# Altium schematic sheet Master.SchDoc: QUTMS Shutdown Board V2.1 - Master Bottom
size A3; DocumentNumber: 1; Revision: 4; SheetNumber: 1; SheetTotal: 7
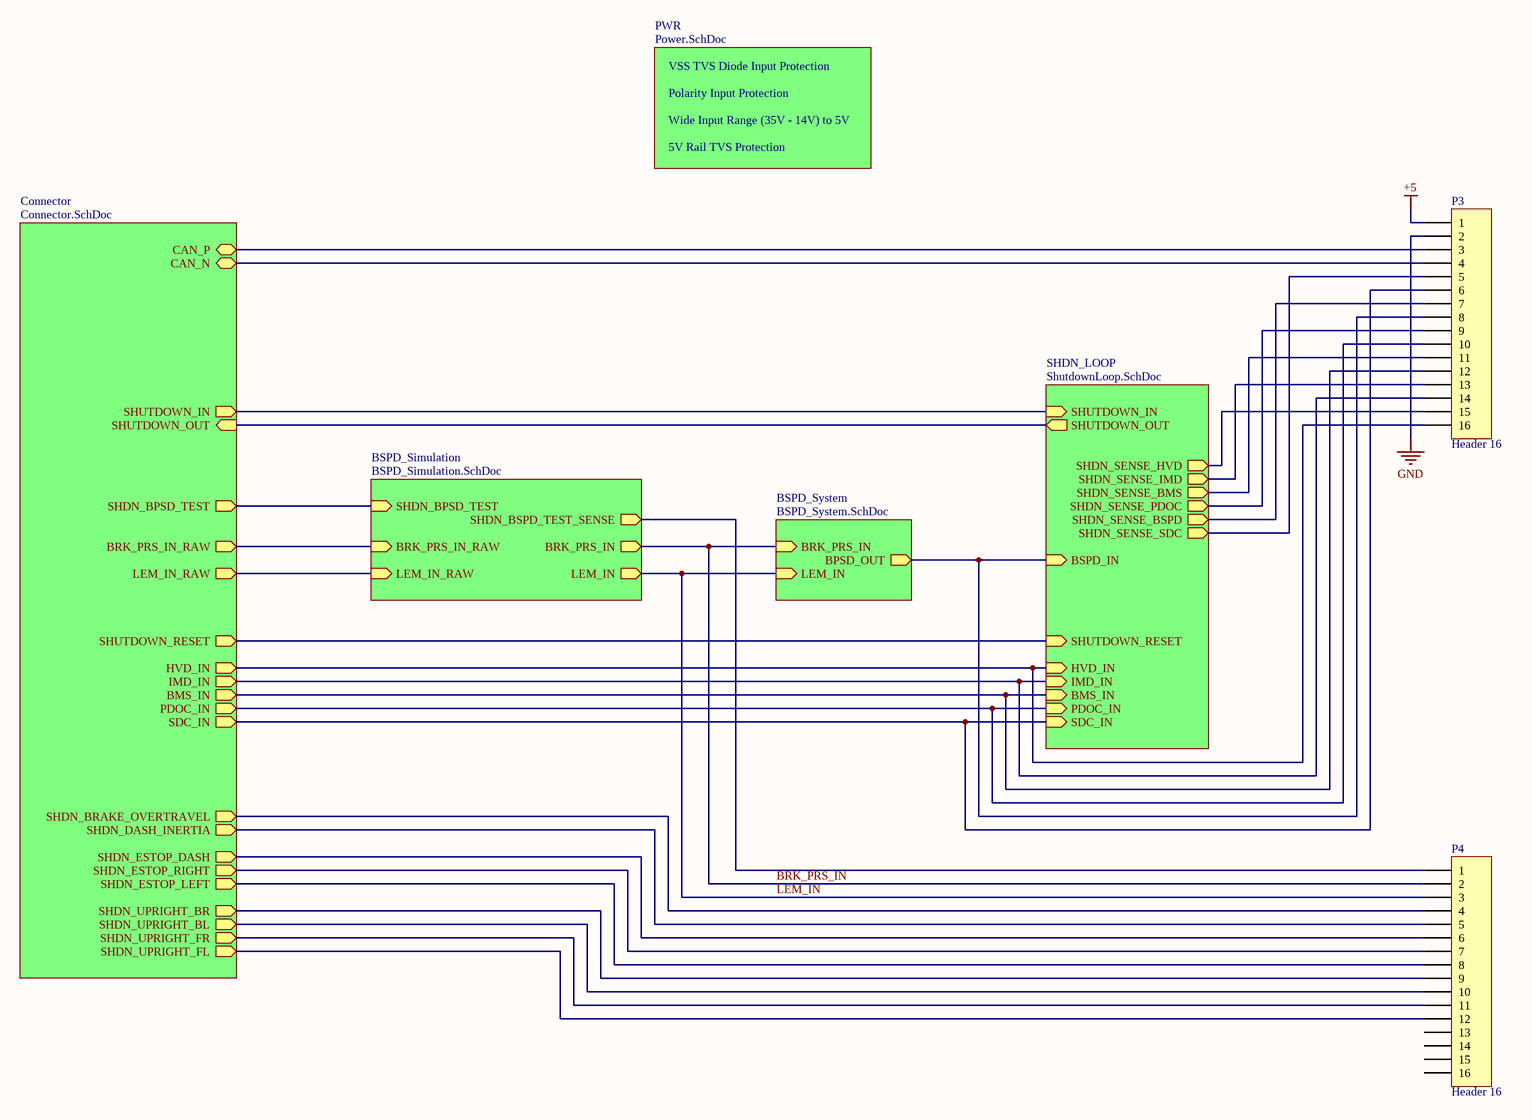
[diagram p0: Master.SchDoc]

## Parts
P3  Header 16  [HDR1X16]
P4  Header 16  [HDR1X16]

## Sub-sheets
BSPD_Simulation = BSPD_Simulation.SchDoc: LEM_IN_RAW (in), SHDN_BSPD_TEST_SENSE (out), BRK_PRS_IN (out), LEM_IN (out), SHDN_BPSD_TEST (in), BRK_PRS_IN_RAW (in)
BSPD_System = BSPD_System.SchDoc: BRK_PRS_IN (in), BPSD_OUT (out), LEM_IN (in)
Connector = Connector.SchDoc: SHDN_BRAKE_OVERTRAVEL (out), SHDN_BPSD_TEST (out), CAN_N (bidir), CAN_P (bidir), SHUTDOWN_IN (out), HVD_IN (out), SHUTDOWN_OUT (in), BRK_PRS_IN_RAW (out), LEM_IN_RAW (out), IMD_IN (out), BMS_IN (out), SHDN_ESTOP_DASH (out), SHDN_DASH_INERTIA (out), PDOC_IN (out), SHUTDOWN_RESET (out), SHDN_ESTOP_RIGHT (out), SHDN_ESTOP_LEFT (out), SHDN_UPRIGHT_BR (out), SHDN_UPRIGHT_BL (out), SHDN_UPRIGHT_FR (out), SHDN_UPRIGHT_FL (out), SDC_IN (out)
PWR = Power.SchDoc: no entries
SHDN_LOOP = ShutdownLoop.SchDoc: SHDN_SENSE_BSPD (out), SHDN_SENSE_PDOC (out), SHDN_SENSE_BMS (out), SHDN_SENSE_IMD (out), HVD_IN (in), SHUTDOWN_RESET (in), IMD_IN (in), BMS_IN (in), PDOC_IN (in), SHUTDOWN_OUT (out), SHUTDOWN_IN (in), BSPD_IN (in), SHDN_SENSE_HVD (out), SDC_IN (in), SHDN_SENSE_SDC (out)

## Nets
+5: P3.1
GND: P3.2
BRK_PRS_IN: P4.2 ; sheet BSPD_System/BRK_PRS_IN, sheet BSPD_Simulation/BRK_PRS_IN
LEM_IN: P4.3 ; sheet BSPD_System/LEM_IN, sheet BSPD_Simulation/LEM_IN
NetP3_3: P3.3 ; sheet Connector/CAN_P
NetP3_4: P3.4 ; sheet Connector/CAN_N
NetP3_5: P3.5 ; sheet SHDN_LOOP/SHDN_SENSE_SDC
NetP3_6: P3.6 ; sheet Connector/SDC_IN, sheet SHDN_LOOP/SDC_IN
NetP3_7: P3.7 ; sheet SHDN_LOOP/SHDN_SENSE_BSPD
NetP3_8: P3.8 ; sheet SHDN_LOOP/BSPD_IN, sheet BSPD_System/BPSD_OUT
NetP3_9: P3.9 ; sheet SHDN_LOOP/SHDN_SENSE_PDOC
NetP3_10: P3.10 ; sheet Connector/PDOC_IN, sheet SHDN_LOOP/PDOC_IN
NetP3_11: P3.11 ; sheet SHDN_LOOP/SHDN_SENSE_BMS
NetP3_12: P3.12 ; sheet Connector/BMS_IN, sheet SHDN_LOOP/BMS_IN
NetP3_13: P3.13 ; sheet SHDN_LOOP/SHDN_SENSE_IMD
NetP3_14: P3.14 ; sheet Connector/IMD_IN, sheet SHDN_LOOP/IMD_IN
NetP3_15: P3.15 ; sheet SHDN_LOOP/SHDN_SENSE_HVD
NetP3_16: P3.16 ; sheet Connector/HVD_IN, sheet SHDN_LOOP/HVD_IN
NetP4_1: P4.1 ; sheet BSPD_Simulation/SHDN_BSPD_TEST_SENSE
NetP4_4: P4.4 ; sheet Connector/SHDN_BRAKE_OVERTRAVEL
NetP4_5: P4.5 ; sheet Connector/SHDN_DASH_INERTIA
NetP4_6: P4.6 ; sheet Connector/SHDN_ESTOP_DASH
NetP4_7: P4.7 ; sheet Connector/SHDN_ESTOP_RIGHT
NetP4_8: P4.8 ; sheet Connector/SHDN_ESTOP_LEFT
NetP4_9: P4.9 ; sheet Connector/SHDN_UPRIGHT_BR
NetP4_10: P4.10 ; sheet Connector/SHDN_UPRIGHT_BL
NetP4_11: P4.11 ; sheet Connector/SHDN_UPRIGHT_FR
NetP4_12: P4.12 ; sheet Connector/SHDN_UPRIGHT_FL
(unnamed): sheet Connector/SHDN_BPSD_TEST, sheet BSPD_Simulation/SHDN_BPSD_TEST
(unnamed): sheet Connector/SHUTDOWN_IN, sheet SHDN_LOOP/SHUTDOWN_IN
(unnamed): sheet Connector/SHUTDOWN_OUT, sheet SHDN_LOOP/SHUTDOWN_OUT
(unnamed): sheet Connector/BRK_PRS_IN_RAW, sheet BSPD_Simulation/BRK_PRS_IN_RAW
(unnamed): sheet Connector/LEM_IN_RAW, sheet BSPD_Simulation/LEM_IN_RAW
(unnamed): sheet Connector/SHUTDOWN_RESET, sheet SHDN_LOOP/SHUTDOWN_RESET

Not connected (* = marked no-connect by the designer): P4 13 14 15 16

## Notes on the sheet
- VSS TVS Diode Input Protection
- Polarity Input Protection
- Wide Input Range (35V - 14V) to 5V
- 5V Rail TVS Protection
- Title
- Size:
- A4
- Number:
- Revision:
- QUT Motorsport, O-120
- O Block, QUT Gardens Point
- Date:
- Time:
- Sheet
- of
- Brisbane, QLD, Australia

## Library data of the parts
P3 P4 = Header 16: Header, 16-Pin; LatestRevisionDate: 17-Jul-2002; LatestRevisionNote: Re-released for DXP Platform.; Publisher: Altium Limited